# EAGLE schematic 8LedBoard (EAGLE 7.2.0)
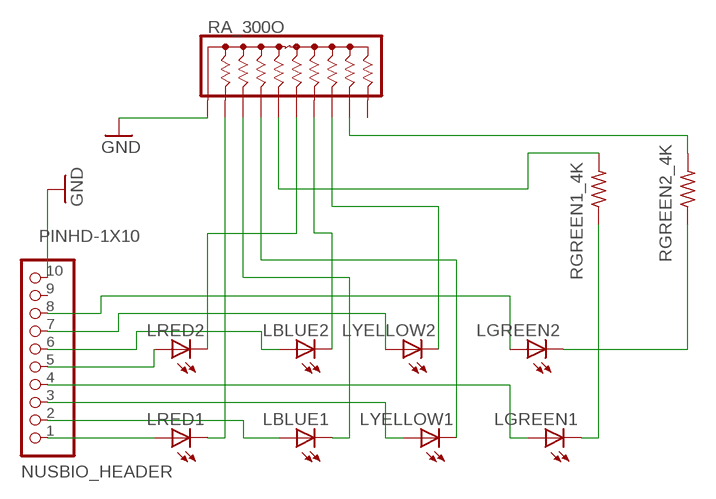
[diagram p0: schematic, sheet 1]

## Parts
LBLUE1  LED5MM  [LED5MM]
LBLUE2  LED5MM  [LED5MM]
LGREEN1  LED5MM  [LED5MM]
LGREEN2  LED5MM  [LED5MM]
LRED1  LED5MM  [LED5MM]
LRED2  LED5MM  [LED5MM]
LYELLOW1  LED5MM  [LED5MM]
LYELLOW2  LED5MM  [LED5MM]
NUSBIO_HEADER  PINHD-1X10  [1X10-BIG]
RA_300O  4610X  [SIP10]
RGREEN1_4K  R-US_0207/10  [0207/10]
RGREEN2_4K  R-US_0207/10  [0207/10]

## Nets
GND: NUSBIO_HEADER.10 RA_300O.1
N$2: LGREEN2.A NUSBIO_HEADER.8
N$3: LRED1.A NUSBIO_HEADER.1
N$4: LBLUE1.A NUSBIO_HEADER.2
N$5: LYELLOW1.A NUSBIO_HEADER.3
N$6: LGREEN1.A NUSBIO_HEADER.4
N$7: LRED2.A NUSBIO_HEADER.5
N$8: LBLUE2.A NUSBIO_HEADER.6
N$9: LYELLOW2.A NUSBIO_HEADER.7
N$10: LRED1.K(C) RA_300O.2
N$11: LBLUE1.K(C) RA_300O.3
N$12: LYELLOW1.K(C) RA_300O.4
N$14: LRED2.K(C) RA_300O.6
N$15: LBLUE2.K(C) RA_300O.7
N$16: LYELLOW2.K(C) RA_300O.8
N$17: LGREEN1.K(C) RGREEN1_4K.1
N$18: RA_300O.5 RGREEN1_4K.2
N$19: LGREEN2.K(C) RGREEN2_4K.1
N$20: RA_300O.9 RGREEN2_4K.2
Unconnected: NUSBIO_HEADER.9 RA_300O.10

## Library data of the parts
LBLUE1 LBLUE2 LGREEN1 LGREEN2 LRED1 LRED2 LYELLOW1 LYELLOW2 = adafruit:LED: LED OSRAM: - CHIPLED LG R971, LG N971, LY N971, LG Q971, LY Q971, LO R971, LY R971 LH N974, LH R974 LS Q976, LO Q976, LY Q976 LO Q996 - Hyper CHIPLED LW Q18S LB Q993, LB Q99A, LB R99A - SideLED LS A670, LO A670, LY A670, LG A670, LP A670 LB A673, LV A673, LT A673, LW A673 LH A674 LY A675 LS A676, LA A676, LO A676, LY A676, LW A676 LS A679, LY A679, LG A679 - Hyper Micro SIDELED® LS Y876, LA Y876, LO Y876, LY Y876 LT Y87S - SmartLED LW L88C, LW L88S LB L89C, LB L89S, LG L890 LS L89K, LO L89K, LY L89K LS L896, LA L896, LO L896, LY L896 - TOPLED LS T670, LO T670, LY T670, LG T670, LP T670 LSG T670, LSP T670, LSY T670, LOP T670, LYG T670 LG T671, LOG T671, LSG T671 LB T673, LV T673, LT T673, LW T673 LH T674 LS T676, LA T676, LO T676, LY T676, LB T676, LH T676, LSB T676, LW T676 LB T67C, LV T67C, LT T67C, LS T67K, LO T67K, LY T67K, LW E67C LS E67B, LA E67B, LO E67B, LY E67B, LB E67C, LV E67C, LT E67C LW T67C LS T679, LY T679, LG T679 LS T770, LO T770, LY T770, LG T770, LP T770 LB T773, LV T773, LT T773, LW T773 LH T774 LS E675, LA E675, LY E675, LS T675 LS T776, LA T776, LO T776, LY T776, LB T776 LHGB T686 LT T68C, LB T68C - Hyper Mini TOPLED® LB M676 - Mini TOPLED Santana® LG M470 LS M47K, LO M47K, LY M47K Source: http://www.osram.convergy.de/
NUSBIO_HEADER = adafruit:PINHD-1X10: Pin header 1x10 0.1" spacing With round pins
RA_300O = resistor-sip:4610X: Bourns 4600X Series - Thick Film Conformal SIPs 4610X-101 Resistor Network Configuration: 101 (Bussed Resistors) Resistance range: 10 ohms to 10 Megaohms Maximum Operating Voltage: 100V Source: http://www.bourns.com/ProductLine.aspx?name=standard_thick_film_networks PDF: http://www.bourns.com/data/global/pdfs/4600X.pdf
RGREEN1_4K RGREEN2_4K = adafruit:R-US_: RESISTOR, American symbol